# Altium project PROJECT1.PrjPCB
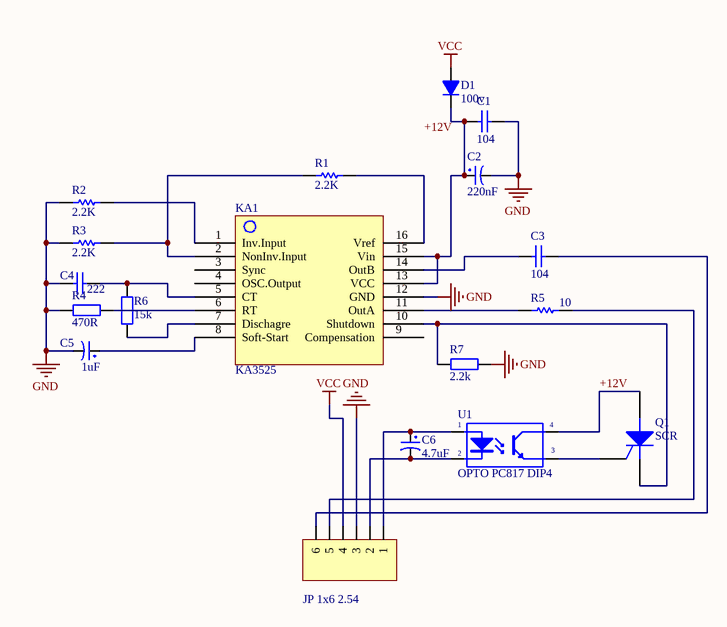
[diagram p0: ProjectTest1.SchDoc]
1 sheet, 18 parts. Net scope: global (net labels, ports and power ports of the same name join across sheets).
Board file: ProjectPCB1.PcbDoc

## Sheet ProjectTest1.SchDoc: Dao Dong KA3525 6F
size A3; Organization: Altium Limited; Address1: 3 Minna Close; Address2: Belrose; Address3: NSW 2085; Address4: Australia

### Parts
C1  104  [tu gom]
C2  220nF  [tu hoa 8mm]
C3  104  [tu gom]
C4  222  [tu gom]
C5  1uF  [tu hoa 5mm]
C6  4.7uF  [tu hoa 5mm]
D1  100v  [DIODE 1A]
JP1  JP 1x6 2.54  [JP 1x6 DC]
KA1  KA3525  [KA3525-DIP16]
Q1  SCR  [QTO-92]
R1  value 2.2K  [R1/4W]  (hidden comment: Res1)
R2  value 2.2K  [R1/4W]  (hidden comment: Res1)
R3  value 2.2K  [R1/4W]  (hidden comment: Res1)
R4  470R  [tro vach 1/4w]
R5  value 10  [R1/4W]  (hidden comment: Res1)
R6  15k  [tro vach 1/4w]
R7  2.2k  [tro vach 1/4w]
U1  OPTO PC817 DIP4  [DIP4]

### Nets
GND: C1.1 C2.2 C4.2 C5.2 JP1.3 KA1.12(GND) R2.2 R3.2 R4.1 R7.2
VCC: D1.1(A) JP1.4
+12V: Q1.1(A) U1.4(C)
NetC1_2: C1.2 C2.1 D1.2(K) KA1.13(VCC) KA1.15(Vin)
NetC3_1: C3.1 JP1.6
NetC3_2: C3.2 KA1.14(OutB)
NetC4_1: C4.1 KA1.5(CT) R6.2
NetC5_1: C5.1 KA1.8(Soft-Start)
NetC6_1: C6.1 JP1.1 U1.1(A)
NetC6_2: C6.2 JP1.2 U1.2(K)
NetJP1_5: JP1.5 R5.1
NetKA1_1: KA1.1(Inv.Input) R2.1
NetKA1_2: KA1.2(NonInv.Input) R1.2 R3.1
NetKA1_6: KA1.6(RT) R4.2
NetKA1_7: KA1.7(Dischagre) R6.1
NetKA1_10: KA1.10(Shutdown) Q1.3(K) R7.1
NetKA1_11: KA1.11(OutA) R5.2
NetKA1_16: KA1.16(Vref) R1.1
NetQ1_2: Q1.2(G) U1.3(E)

Not connected (* = marked no-connect by the designer): KA1 3(Sync) 4(OSC.Output) 9(Compensation)

### Notes on the sheet
- Labels drawn without touching a wire or pin: +12V
- Title
- Size:
- Date:
- A3
- Number:
- Time:
- Revision:
- Sheet
- of
- File:

### Library data of the parts
C1 C3 = Tu gom 104 50V: C?m; So_Chan: 2; Ten_Linh_Kien: T? g?m 104 100nF 50V; Don_Vi: Con; Ma_Hang: MH004761; Chung_Loai: C?m; Kieu_Chan: *
C2 = Tu Hoa 220uF 35V 8x12: C?m; Don_Vi: Con; So_Chan: 2; Ten_Linh_Kien: T? Hóa 220uF 35V 8x12MM; Ma_Hang: MH006553; Chung_Loai: C?m; Kieu_Chan: *
C4 = Tu gom 222 50V: C?m; Don_Vi: Con; So_Chan: 2; Ten_Linh_Kien: T? g?m 222-2.2nF 50V; Ma_Hang: MH004770; Chung_Loai: C?m; Kieu_Chan: *
C5 = Tu Hoa 1uF 50V 5x11: C?m; Don_Vi: Con; So_Chan: 2; Ten_Linh_Kien: T? Hóa 1uF 50V 5x11MM; Ma_Hang: MH001355; Chung_Loai: C?m; Kieu_Chan: *
C6 = Tu Hoa 4.7uF 50V 5x11: C?m; Don_Vi: Con; So_Chan: 2; Ten_Linh_Kien: T? Hóa 4.7uF 50V 5x11MM; Ma_Hang: MH001357; Chung_Loai: C?m; Kieu_Chan: *
D1 = Diode 1N4007: C?m; Ten_Linh_Kien: Diode 1N4007 1A (DIP); Don_Vi: Con; Ma_Hang: MH001063; Ghi Chu: *; Kieu_Chan: *; Chung_Loai: C?m
JP1 = JP 1x6 2.54 Duc Cong: C?m; Ten_Linh_Kien: Jump Ðon Ð?c 2.54MM 1x40P Cong Ð?ng; Don_Vi: Con; Ma_Hang: MH000904; Ghi_Chu: *; Kieu_Chan: *; Chung_Loai: C?m
Q1 = SCR: Silicon Controlled Rectifier; Published: 8-Jun-2000; LatestRevisionDate: 17-Jul-2002; LatestRevisionNote: Re-released for DXP Platform.; PackageReference: TO-220-AB; Publisher: Altium Limited; Code_JEDEC: TO-220-AB
R1-R3 R5 = Res1_1: Resistor; Manufacturer: Generic Components; Class: Passive; Published: 08/06/2000; Publisher: Altium Hobart Technology Centre; SubClass: Resistor
R4 = Tro Vach 1/4W 1% 330R: C?m; Don_Vi: Con; So_Chan: 2; Ten_Linh_Kien: Tr? V?ch 1/4w 1% 330R; Ma_Hang: MH006348; Chung_Loai: C?m; Kieu_Chan: *
R6 R7 = Tro Vach 1/4W 5% 2.2k: C?m; Don_Vi: Con; So_Chan: 2; Ten_Linh_Kien: Tr? V?ch 1/4w 5% 2.2k; Ma_Hang: MH007293; Chung_Loai: C?m; Kieu_Chan: *
U1 = OPTO PC817 DIP4: Single Opto; Value: PC817